# Altium schematic sheet STM32_RS485.SchDoc
size Letter
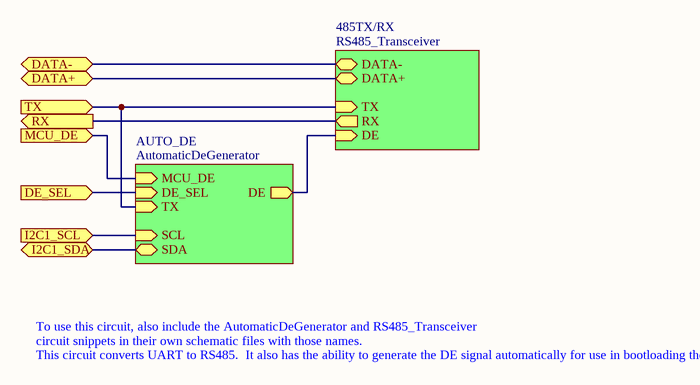
[diagram p0: STM32_RS485.SchDoc]

## Sub-sheets
485TX/RX = RS485_Transceiver: DATA- (bidir), DATA+ (bidir), TX (in), RX (out), DE (in)
AUTO_DE = AutomaticDeGenerator: MCU_DE (in), DE_SEL (in), TX (in), DE (out), SCL (in), SDA (bidir)

## Ports
DATA+ (bidir), DATA- (bidir), DE_SEL (in), I2C1_SCL (in), I2C1_SDA (bidir), MCU_DE (in), RX (out), TX (in)

## Nets
DATA+: port DATA+, sheet 485TX/RX/DATA+
DATA-: port DATA-, sheet 485TX/RX/DATA-
DE_SEL: port DE_SEL, sheet AUTO_DE/DE_SEL
I2C1_SCL: port I2C1_SCL, sheet AUTO_DE/SCL
I2C1_SDA: port I2C1_SDA, sheet AUTO_DE/SDA
MCU_DE: port MCU_DE, sheet AUTO_DE/MCU_DE
RX: port RX, sheet 485TX/RX/RX
TX: port TX, sheet 485TX/RX/TX, sheet AUTO_DE/TX
(unnamed): sheet 485TX/RX/DE, sheet AUTO_DE/DE

## Notes on the sheet
- To use this circuit, also include the AutomaticDeGenerator and RS485_Transceiver
- circuit snippets in their own schematic files with those names.
- This circuit converts UART to RS485.  It also has the ability to generate the DE signal automatically for use in bootloading the STM32.